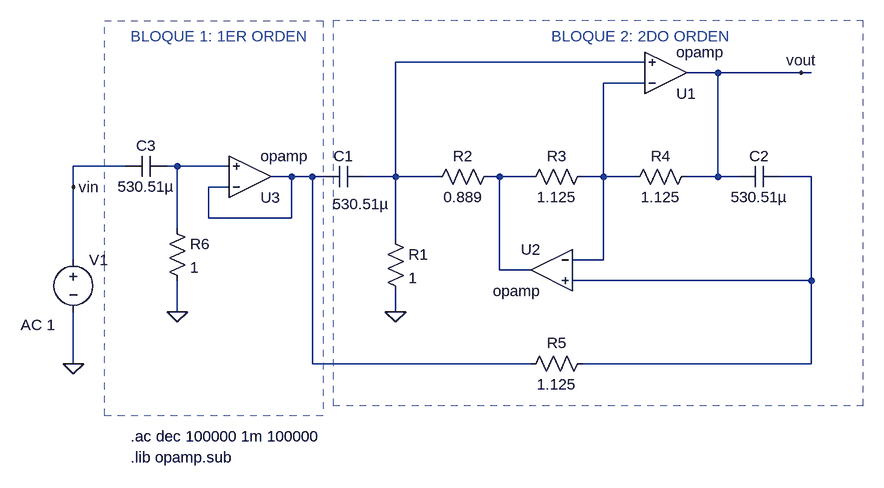
[diagram p0: schematic implementacion.asc]
implementacion.asc, the LTspice schematic file:
Version 4
SHEET 1 1244 680
WIRE -16 -224 -400 -224
WIRE 96 -208 48 -208
WIRE 224 -208 96 -208
WIRE 240 -208 224 -208
WIRE -16 -192 -80 -192
WIRE -816 -64 -896 -64
WIRE -736 -64 -752 -64
WIRE -656 -64 -736 -64
WIRE -560 -48 -592 -48
WIRE -528 -48 -560 -48
WIRE -512 -48 -528 -48
WIRE -400 -48 -400 -224
WIRE -400 -48 -448 -48
WIRE -336 -48 -400 -48
WIRE -240 -48 -256 -48
WIRE -192 -48 -240 -48
WIRE -80 -48 -80 -192
WIRE -80 -48 -112 -48
WIRE -32 -48 -80 -48
WIRE 96 -48 96 -208
WIRE 96 -48 48 -48
WIRE 128 -48 96 -48
WIRE 240 -48 192 -48
WIRE -896 -32 -896 -64
WIRE -656 -32 -688 -32
WIRE -688 16 -688 -32
WIRE -560 16 -560 -48
WIRE -560 16 -688 16
WIRE -736 32 -736 -64
WIRE -400 48 -400 -48
WIRE -896 80 -896 -32
WIRE -80 80 -80 -48
WIRE -80 80 -128 80
WIRE -240 96 -240 -48
WIRE -192 96 -240 96
WIRE 240 112 240 -48
WIRE 240 112 -128 112
WIRE -736 160 -736 112
WIRE -400 160 -400 128
WIRE -896 240 -896 160
WIRE -528 240 -528 -48
WIRE -192 240 -528 240
WIRE 240 240 240 112
WIRE 240 240 -112 240
FLAG -896 240 0
FLAG -896 -32 vin
FLAG -400 160 0
FLAG -736 160 0
FLAG 224 -208 vout
SYMBOL voltage -896 64 R0
WINDOW 123 -81 116 Left 2
WINDOW 39 0 0 Left 0
SYMATTR Value2 AC 1
SYMATTR InstName V1
SYMATTR Value ""
SYMBOL OpAmps\\opamp 16 -144 M180
SYMATTR InstName U1
SYMBOL cap -448 -64 R90
WINDOW 0 0 32 VBottom 2
WINDOW 3 43 5 VTop 2
SYMATTR InstName C1
SYMATTR Value 530.51µ
SYMATTR SpiceLine Rser=0 Lser=0 Rpar=0 Cpar=0
SYMBOL res -416 32 R0
SYMATTR InstName R1
SYMATTR Value 1
SYMBOL res -240 -64 R90
WINDOW 0 0 56 VBottom 2
WINDOW 3 32 56 VTop 2
SYMATTR InstName R2
SYMATTR Value 0.889
SYMBOL res -96 -64 R90
WINDOW 0 0 56 VBottom 2
WINDOW 3 32 56 VTop 2
SYMATTR InstName R3
SYMATTR Value 1.125
SYMBOL res 64 -64 R90
WINDOW 0 0 56 VBottom 2
WINDOW 3 32 56 VTop 2
SYMATTR InstName R4
SYMATTR Value 1.125
SYMBOL cap 192 -64 R90
WINDOW 0 0 32 VBottom 2
WINDOW 3 32 32 VTop 2
SYMATTR InstName C2
SYMATTR Value 530.51µ
SYMATTR SpiceLine Rser=0 Lser=0 Rpar=0 Cpar=0
SYMBOL res -96 224 R90
WINDOW 0 0 56 VBottom 2
WINDOW 3 32 56 VTop 2
SYMATTR InstName R5
SYMATTR Value 1.125
SYMBOL OpAmps\\opamp -160 32 M0
SYMATTR InstName U2
SYMBOL OpAmps\\opamp -624 16 M180
SYMATTR InstName U3
SYMBOL cap -752 -80 R90
WINDOW 0 0 32 VBottom 2
WINDOW 3 32 32 VTop 2
SYMATTR InstName C3
SYMATTR Value 530.51µ
SYMATTR SpiceLine Rser=0 Lser=0 Rpar=0 Cpar=0
SYMBOL res -752 16 R0
SYMATTR InstName R6
SYMATTR Value 1
TEXT -808 384 Left 2 !.lib opamp.sub
TEXT -808 352 Left 2 !.ac dec 100000 1m 100000
TEXT -808 -264 Left 2 ;BLOQUE 1: 1ER ORDEN
TEXT -160 -264 Left 2 ;BLOQUE 2: 2DO ORDEN
RECTANGLE Normal -512 320 -848 -288 2
RECTANGLE Normal 320 -288 -496 304 2

The netlist it stands for:
* implementacion.asc
V1 vin 0 AC 1
XU1 N002 N001 vout opamp Aol=100K GBW=10Meg  ; pins invin noninvin out
C1 N001 N004 530.51µ Rser=0 Lser=0 Rpar=0 Cpar=0
R1 N001 0 1
R2 N005 N001 0.889
R3 N002 N005 1.125
R4 vout N002 1.125
C2 N006 vout 530.51µ Rser=0 Lser=0 Rpar=0 Cpar=0
R5 N006 N004 1.125
XU2 N002 N006 N005 opamp Aol=100K GBW=10Meg  ; pins invin noninvin out
XU3 N004 N003 N004 opamp Aol=100K GBW=10Meg  ; pins invin noninvin out
C3 N003 vin 530.51µ Rser=0 Lser=0 Rpar=0 Cpar=0
R6 N003 0 1
.lib opamp.sub
.ac dec 100000 1m 100000
* BLOQUE 1: 1ER ORDEN
* BLOQUE 2: 2DO ORDEN
.backanno
.end